# EAGLE board EtherMegaR3 (EAGLE 9.4.2), part 1 of 2
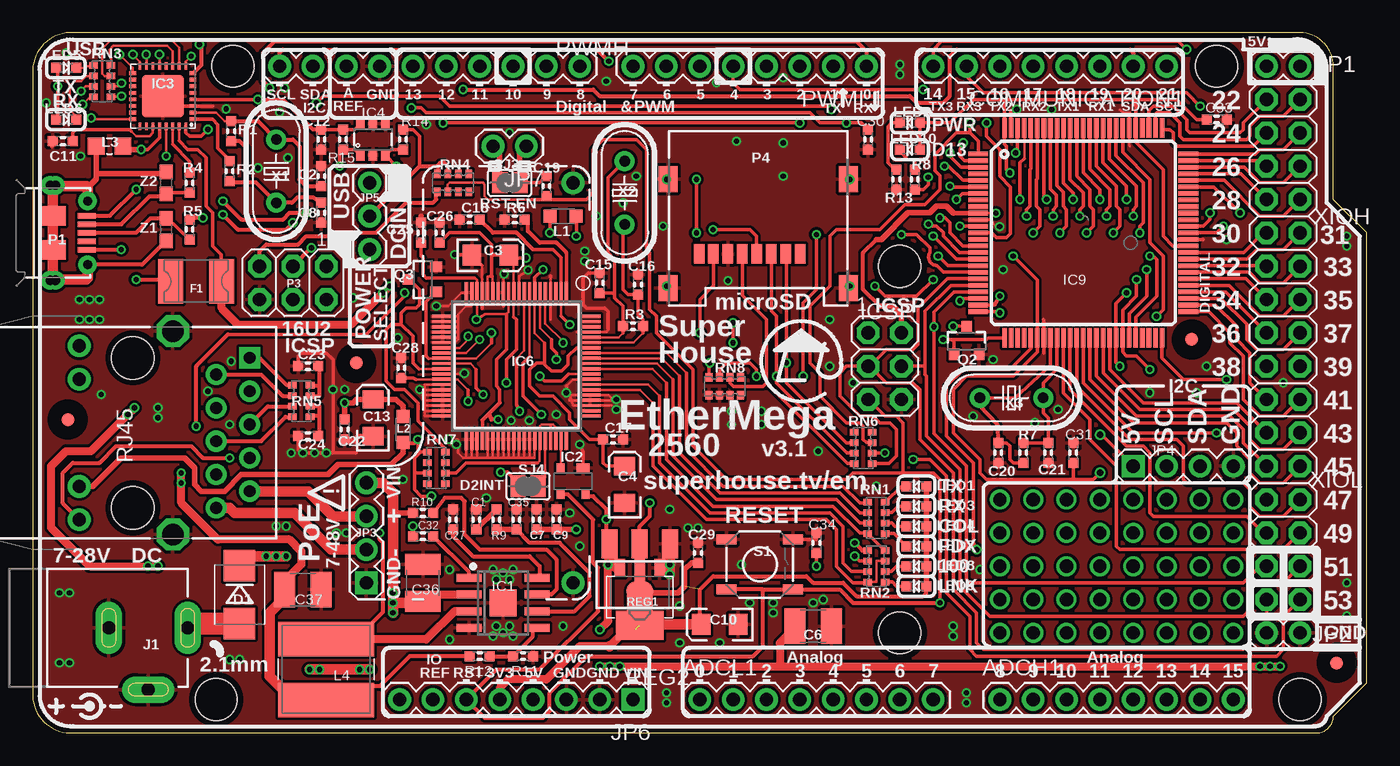
[diagram p1: board, top side]
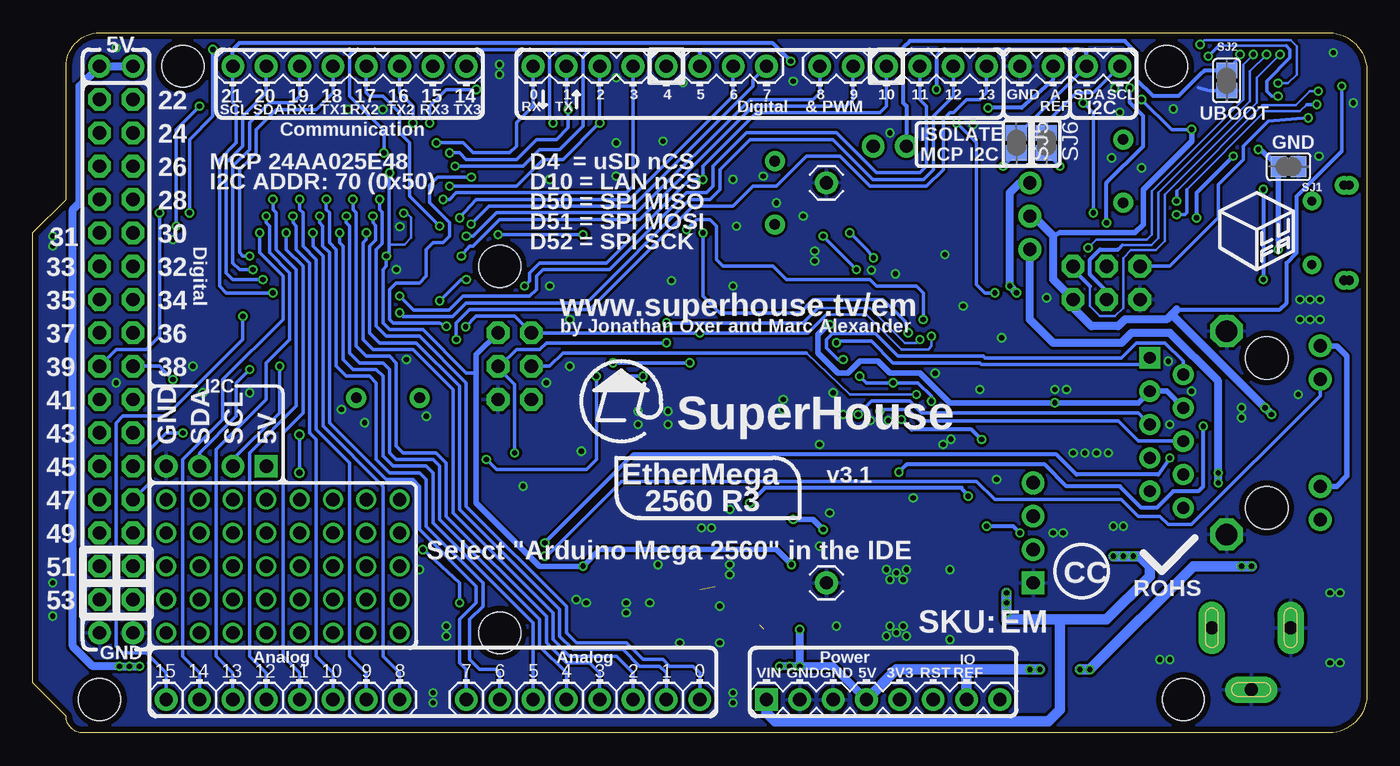
[diagram p2: board, bottom side, seen from below]

Size 101.6 x 53.34 mm. Coordinates in mm from the lower left corner, seen from the top.
Outline: 0,2.54 arc74 2.54,0 97.79,0 arc90 99.06,1.27 101.6,3.81 101.6,38.1 99.06,40.64 99.06,50.8 arc90 96.52,53.34 2.54,53.34 arc74 0,50.8 0,2.54
Copper layers (1*16): Top 0.035mm / dielectric 1.5mm / Bottom 0.035mm
Design rules "default": minimum track width 8mil, minimum drill 15mil, track to track 8mil, track to pad 8mil, pad to pad 8mil, via to via 8mil, smd to smd 6mil, copper to edge 18mil, drill to drill 8mil, minimum pad ring 14mil, minimum via ring 6mil, stop-mask expansion 4mil, vias tented up to drill 25mil, thermal gap 10mil
Holes 3.2 mm at 66.04,35.56 66.04,7.62 13.97,2.54 15.24,50.8 96.52,2.54 90.17,50.8
tRestrict: area 23.6,27.2 to 25.7,29.2; area 87.2,29 to 89.3,31; area 1.7,22.9 to 3.7,24.9; area 98.3,4.3 to 100.3,6.3

## Footprints (pad centres in the part's own frame; a part is rotated, then mirrored left to right if it is on the bottom)
1X08-S = drill 1.016: 1 0,0; 2 2.54,0; 3 5.08,0; 4 7.62,0; 5 10.16,0; 6 12.7,0; 7 15.24,0; 8 17.78,0
C0603 = smd 0.762 x 0.762: 1 -0.762,0; 2 0.762,0
EIA3216 = smd 1.4 x 1.6: A 1.4,0; C -1.4,0
C1210 = smd 1.6 x 2.7: 1 -1.4,0; 2 1.4,0
0603 = smd 0.762 x 0.762: 1 -0.762,0; 2 0.762,0
SMB-DIODE = smd 2.4 x 2.4: A 2.2,0; C -2.2,0
1812 = smd 1.9 x 3.4: 1 -1.95,0; 2 1.95,0
FIDUCIAL-1X2.5 = smd 1 x 1: 1 0,0
SO08T = smd 1.905 x 0.6: 1 -2.6,1.905; 2 -2.6,0.635; 3 -2.6,-0.635; 4 -2.6,-1.905; 5 2.6,-1.905; 6 2.6,-0.635; 7 2.6,0.635; 8 2.6,1.905 | smd 2.057 x 2.057: 9 0,0
SOT143-R = smd 1 x 0.7: 1 -0.75,-1 | smd 0.6 x 0.7: 2 0.95,-1; 3 0.95,1; 4 -0.95,1
ATMEL_QFN32 = smd 0.6 x 0.3: 1 -2.3,1.75; 2 -2.3,1.25; 3 -2.3,0.75; 4 -2.3,0.25; 5 -2.3,-0.25; 6 -2.3,-0.75; 7 -2.3,-1.25; 8 -2.3,-1.75; 17 2.3,-1.75; 18 2.3,-1.25; 19 2.3,-0.75; 20 2.3,-0.25; 21 2.3,0.25; 22 2.3,0.75; 23 2.3,1.25; 24 2.3,1.75 | smd 0.3 x 0.6: 9 -1.75,-2.3; 10 -1.25,-2.3; 11 -0.75,-2.3; 12 -0.25,-2.3; 13 0.25,-2.3; 14 0.75,-2.3; 15 1.25,-2.3; 16 1.75,-2.3; 25 1.75,2.3; 26 1.25,2.3; 27 0.75,2.3; 28 0.25,2.3; 29 -0.25,2.3; 30 -0.75,2.3; 31 -1.25,2.3; 32 -1.75,2.3 | smd 3.2 x 3.2: EXP 0,0
SOT23-6 = smd 0.65 x 0.8: 1 -0.95,-1.2; 2 0,-1.2; 3 0.95,-1.2; 4 0.95,1.2; 5 0,1.2; 6 -0.95,1.2
SQFP80 = smd 1.6 x 0.25: 1 -5.6,3.8; 2 -5.6,3.4; 3 -5.6,3; 4 -5.6,2.6; 5 -5.6,2.2; 6 -5.6,1.8; 7 -5.6,1.4; 8 -5.6,1; 9 -5.6,0.6; 10 -5.6,0.2; 11 -5.6,-0.2; 12 -5.6,-0.6; 13 -5.6,-1; 14 -5.6,-1.4; 15 -5.6,-1.8; 16 -5.6,-2.2; 17 -5.6,-2.6; 18 -5.6,-3; 19 -5.6,-3.4; 20 -5.6,-3.8; 41 5.6,-3.8; 42 5.6,-3.4; 43 5.6,-3; 44 5.6,-2.6; 45 5.6,-2.2; 46 5.6,-1.8; 47 5.6,-1.4; 48 5.6,-1; 49 5.6,-0.6; 50 5.6,-0.2; 51 5.6,0.2; 52 5.6,0.6; 53 5.6,1; 54 5.6,1.4; 55 5.6,1.8; 56 5.6,2.2; 57 5.6,2.6; 58 5.6,3; 59 5.6,3.4; 60 5.6,3.8 | smd 0.25 x 1.6: 21 -3.8,-5.6; 22 -3.4,-5.6; 23 -3,-5.6; 24 -2.6,-5.6; 25 -2.2,-5.6; 26 -1.8,-5.6; 27 -1.4,-5.6; 28 -1,-5.6; 29 -0.6,-5.6; 30 -0.2,-5.6; 31 0.2,-5.6; 32 0.6,-5.6; 33 1,-5.6; 34 1.4,-5.6; 35 1.8,-5.6; 36 2.2,-5.6; 37 2.6,-5.6; 38 3,-5.6; 39 3.4,-5.6; 40 3.8,-5.6; 61 3.8,5.6; 62 3.4,5.6; 63 3,5.6; 64 2.6,5.6; 65 2.2,5.6; 66 1.8,5.6; 67 1.4,5.6; 68 1,5.6; 69 0.6,5.6; 70 0.2,5.6; 71 -0.2,5.6; 72 -0.6,5.6; 73 -1,5.6; 74 -1.4,5.6; 75 -1.8,5.6; 76 -2.2,5.6; 77 -2.6,5.6; 78 -3,5.6; 79 -3.4,5.6; 80 -3.8,5.6
TQFP100 = smd 1.5 x 0.35: 1 -8,6; 2 -8,5.5; 3 -8,5; 4 -8,4.5; 5 -8,4; 6 -8,3.5; 7 -8,3; 8 -8,2.5; 9 -8,2; 10 -8,1.5; 11 -8,1; 12 -8,0.5; 13 -8,0; 14 -8,-0.5; 15 -8,-1; 16 -8,-1.5; 17 -8,-2; 18 -8,-2.5; 19 -8,-3; 20 -8,-3.5; 21 -8,-4; 22 -8,-4.5; 23 -8,-5; 24 -8,-5.5; 25 -8,-6; 51 8,-6; 52 8,-5.5; 53 8,-5; 54 8,-4.5; 55 8,-4; 56 8,-3.5; 57 8,-3; 58 8,-2.5; 59 8,-2; 60 8,-1.5; 61 8,-1; 62 8,-0.5; 63 8,0; 64 8,0.5; 65 8,1; 66 8,1.5; 67 8,2; 68 8,2.5; 69 8,3; 70 8,3.5; 71 8,4; 72 8,4.5; 73 8,5; 74 8,5.5; 75 8,6 | smd 0.35 x 1.5: 26 -6,-8; 27 -5.5,-8; 28 -5,-8; 29 -4.5,-8; 30 -4,-8; 31 -3.5,-8; 32 -3,-8; 33 -2.5,-8; 34 -2,-8; 35 -1.5,-8; 36 -1,-8; 37 -0.5,-8; 38 0,-8; 39 0.5,-8; 40 1,-8; 41 1.5,-8; 42 2,-8; 43 2.5,-8; 44 3,-8; 45 3.5,-8; 46 4,-8; 47 4.5,-8; 48 5,-8; 49 5.5,-8; 50 6,-8; 76 6,8; 77 5.5,8; 78 5,8; 79 4.5,8; 80 4,8; 81 3.5,8; 82 3,8; 83 2.5,8; 84 2,8; 85 1.5,8; 86 1,8; 87 0.5,8; 88 0,8; 89 -0.5,8; 90 -1,8; 91 -1.5,8; 92 -2,8; 93 -2.5,8; 94 -3,8; 95 -3.5,8; 96 -4,8; 97 -4.5,8; 98 -5,8; 99 -5.5,8; 100 -6,8
2X03 = drill 1.016 octagon: 1 -2.54,-1.27; 2 -2.54,1.27; 3 0,-1.27; 4 0,1.27; 5 2.54,-1.27; 6 2.54,1.27
POWER_JACK_SLOTS = drill 1 pad 2 long: GND 0,7.7; GNDBREAK 4.7,10.7; PWR 0,13.7
1X02 = drill 1.016: 1 0,0; 2 2.54,0
FT-POE-MODULE-CLEAN = drill 1.016 square: 1 0,0 | drill 1.016: 2 2.54,0; 3 5.08,0; 4 7.62,0; MNT1 0,-15.748; MNT2 30.48,-15.748
1X04 = drill 1.016 square: 1 0,0 | drill 1.016: 2 2.54,0; 3 5.08,0; 4 7.62,0
1X03-P = drill 1.016: 1 0,0; 2 2.54,0; 3 5.08,0
1X08 = drill 1.016 square: 1 0,0 | drill 1.016: 2 2.54,0; 3 5.08,0; 4 7.62,0; 5 10.16,0; 6 12.7,0; 7 15.24,0; 8 17.78,0
L2012C = smd 1 x 1: 1 -1,0; 2 1,0
0805-LARGE = smd 1.27 x 1.27: 1 -1.016,0; 2 1.016,0
CDRH = smd 7.3 x 2.65: 1 0,2.325; 2 0,-2.325
LED-0603 = smd 0.762 x 0.762: A -0.762,0; C 0.762,0
USB-MICROB-MB05PMXX = smd 0.4 x 1.35: D+ 0,2.575; D- -0.65,2.575; GND 1.3,2.575; ID 0.65,2.575; VBUS -1.3,2.575 | smd 1.5 x 2: FIX1 -1.3,0; FIX2 1.3,0 | drill 0.7: PIN1 -2.425,2.65; PIN2 2.425,2.65; SLOT1 -3.625,-0.2; SLOT2 3.625,-0.2; TAB1 -3.625,0.2; TAB2 3.625,0.2
MOLEX-SD-500901-003 = smd 0.8 x 1.5: 1 -3.2,9.35; 2 -2.1,9.35; 3 -1,9.35; 4 0.1,9.35; 5 1.2,9.35; 6 2.3,9.35; 7 3.4,9.35; 8 4.5,9.35 | smd 1.45 x 2: GND1 6.875,11.95; GND2 -6.875,11.95; GND3 6.875,3.65; GND4 -6.875,3.65
1X10 = drill 1.016: 1 0,0; 2 2.54,0; 3 5.08,0; 4 7.62,0; 5 10.16,0; 6 12.7,0; 7 15.24,0; 8 17.78,0; 9 20.32,0; 10 22.86,0
SOT23-3 = smd 0.8 x 0.9: 1 -0.95,-1; 2 0.95,-1; 3 0,1.1
R0603 = smd 0.762 x 0.762: 1 -0.762,0; 2 0.762,0
SOT89 = smd 0.8 x 1.4: 1 -1.524,-1.905; 3 1.524,-1.905 | smd 0.8 x 1.9: 2 0,-1.651 | smd 2.032 x 3.65: 4 0,0.94
SOT-223 = smd 1.219 x 2.235: 1 -2.311,-3.099; 2 0,-3.099; 3 2.311,-3.099 | smd 3.6 x 2.2: 4 0,3.099
CAY16 = smd 0.5 x 0.65: 1 -1.2,-0.675; 2 -0.4,-0.675; 3 0.4,-0.675; 4 1.2,-0.675; 5 1.2,0.675; 6 0.4,0.675; 7 -0.4,0.675; 8 -1.2,0.675
TACTILE_SMD-6MM = smd 1.524 x 0.762: 1 -2.54,1.905; 2 2.54,1.905; 3 -2.54,-1.905; 4 2.54,-1.905
SJ = smd 1.168 x 1.6: 1 -0.762,0; 2 0.762,0
SJC = smd 1.168 x 1.6: 1 -0.762,0; 2 0.762,0
HY931147C = drill 1.63 octagon: GND1 3.05,7.745; GND2 3.05,-7.745 | drill 0.9 square: P$1 8.89,5.715 | drill 0.9: P$2 6.35,4.445; P$3 8.89,3.175; P$4 6.35,1.905; P$5 8.89,0.635; P$6 6.35,-0.635; P$7 8.89,-1.905; P$8 6.35,-3.175; P$9 8.89,-4.445; P$10 6.35,-5.715 | drill 1.016: P$11 -4.08,6.625; P$12 -4.08,4.085; P$13 -4.08,-4.085; P$14 -4.08,-6.625 | hole 3.25: 0,5.715; 0,-5.715
HC49U-V = drill 0.813: 1 -2.413,0; 2 2.413,0
2X08 = drill 1.016 octagon: 1 -8.89,-1.27; 2 -8.89,1.27; 3 -6.35,-1.27; 4 -6.35,1.27; 5 -3.81,-1.27; 6 -3.81,1.27; 7 -1.27,-1.27; 8 -1.27,1.27; 9 1.27,-1.27; 10 1.27,1.27; 11 3.81,-1.27; 12 3.81,1.27; 13 6.35,-1.27; 14 6.35,1.27; 15 8.89,-1.27; 16 8.89,1.27
0603' = smd 1.1 x 1: 1 -0.85,0; 2 0.85,0

## Placement (x,y rotation side)
ADCH1  M08-SOCKET  [1X08-S]  73.66,2.54 0 top
ADCL1  M08-SOCKET  [1X08-S]  50.8,2.54 0 top
C1  2.2nF 0603  [C0603]  33.78,16.26 90 top
C2  22pF 0603  [C0603]  21.97,42.42 270 top
C3  10uF 6.3V A TANT  [EIA3216]  34.85,36.4 0 top
C4  10uF 6.3V A TANT  [EIA3216]  45.09,18.92 90 top
C6  47uF 50V 1210 ceramic  [C1210]  59.44,8.13 180 top
C7  100nF 0603  [C0603]  38.35,16.26 90 top
C8  22pF 0603  [C0603]  21.97,39.62 90 top
C9  1uF 0603  [C0603]  39.88,16.26 90 top
C10  10uF 6.3V A TANT  [EIA3216]  52.32,8.26 180 top
C11  1uF 0603  [C0603]  2.29,45.09 180 top
C12  100nF 0603  [C0603]  21.97,45.21 270 top
C13  10uF 6.3V A TANT  [EIA3216]  25.91,24 90 top
C15  13pF  [C0603]  43.18,34.29 90 top
C16  13pF  [C0603]  46.1,34.16 90 top
C17  100nF  [C0603]  44.2,22.35 0 top
C18  10nF  [0603]  33.27,39.12 180 top
C19  100nF 0603  [C0603]  39.12,41.66 270 top
C20  22pF 0603  [C0603]  73.53,21.34 90 top
C21  22pF 0603  [C0603]  77.34,21.34 90 top
C22  100nF  [C0603]  23.75,23.11 270 top
C23  100nF  [C0603]  20.95,27.94 180 top
C24  100nF  [C0603]  20.95,22.61 180 top
C25  100nF  [C0603]  29.59,38.1 90 top
C26  100nF  [C0603]  30.99,38.1 90 top
C27  100nF 0603  [C0603]  32,16.26 90 top
C28  100nF  [C0603]  28.07,27.81 90 top
C29  100nF 0603  [C0603]  50.67,13.72 90 top
C30  100nF  [C0603]  63.63,45.21 270 top
C31  100nF  [C0603]  79.25,21.34 90 top
C32  10nF 50V 0603  [C0603]  29.72,14.99 0 top
C33  100nF  [C0603]  90.17,46.74 0 top
C34  100nF  [C0603]  59.69,14.48 90 top
C35  22pF NOT PLACED  [C0603]  36.83,16.26 90 top
C36  10uF 50V 1210 ceramic  [C1210]  29.72,11.43 90 top
C37  22uF 10V 1210 ceramic  [C1210]  20.57,10.92 0 top
COMMUNICATION1  M08-SOCKET  [1X08-S]  86.36,50.8 180 top
D1  1N4004 SMB  [SMB-DIODE]  15.75,10.54 270 top
F1  500mA PTC 1812  [1812]  12.45,34.42 0 top
FID1  FIDUCIAL1X2.5  [FIDUCIAL-1X2.5]  24.64,28.19 0 top
FID2  FIDUCIAL1X2.5  [FIDUCIAL-1X2.5]  88.27,29.97 0 top
FID3  FIDUCIAL1X2.5  [FIDUCIAL-1X2.5]  2.67,23.88 0 top
FID4  FIDUCIAL1X2.5  [FIDUCIAL-1X2.5]  99.31,5.33 90 top
IC1  EUP3476SO08T  [SO08T]  35.81,9.91 0 top
IC2  APX811-44UG-7  [SOT143-R]  41.15,19.18 180 top
IC3  ATMEGA16U2-MU  [ATMEL_QFN32]  9.91,48.51 180 top
IC4  MCP24AA025E48  [SOT23-6]  25.91,45.21 0 top
IC6  W5100SQFP80  [SQFP80]  36.83,27.94 270 top
IC9  ATMEGA2560-16AU  [TQFP100]  80.01,38.1 0 top
ICSP  ICSP:MAIN  [2X03]  64.9,27.94 270 top
J1  DC_2_1MM  [POWER_JACK_SLOTS]  -1.91,8 270 top
JP1  [1X02]  93.98,50.8 0 top
JP2  [1X02]  93.98,7.62 0 top
JP3  FT-POE-MODULE  [FT-POE-MODULE-CLEAN]  25.4,11.43 90 top
JP4  [1X04]  83.82,20.32 0 top
JP5  [1X03-P]  25.65,41.91 270 top
JP6  [1X08]  45.72,2.54 180 top
JP7  [1X02]  37.59,44.7 180 top
L1  1uH 250mA 0805  [L2012C]  40.39,39.37 0 top
L2  1uH 250mA 0805  [L2012C]  28.19,23.11 90 top
L3  0805 INDUCTOR  [0805-LARGE]  5.84,44.7 0 top
L4  CDRH6D38SMT  [CDRH]  22.35,4.83 0 top
LED1  YELLOW  [LED-0603]  67.31,18.8 180 top
LED2  PWR/BLUE  [LED-0603]  66.8,46.48 180 top
LED3  YELLOW  [LED-0603]  67.31,17.27 180 top
LED4  RED  [LED-0603]  67.31,15.75 180 top
LED5  TX/YEL  [LED-0603]  2.54,50.67 0 top
LED6  RX/GRN  [LED-0603]  2.54,46.74 0 top
LED7  GREEN  [LED-0603]  67.31,14.22 180 top
LED8  GREEN  [LED-0603]  67.31,12.7 180 top
LED9  YELLOW  [LED-0603]  67.31,11.18 180 top
LED10  D13/RED  [LED-0603]  66.8,44.45 180 top
P1  USB-6P-SMT  [USB-MICROB-MB05PMXX]  1.52,38.1 270 top
P3  ICSP:USB  [2X03]  19.81,34.29 180 top
P4  microSD  [MOLEX-SD-500901-003]  55.24,45.85 180 top
PWMH  [1X10]  41.66,50.8 180 top
PWML1  M08-SOCKET  [1X08-S]  63.5,50.8 180 top
Q2  2N7002  [SOT23-3]  71.12,29.84 0 top
Q3  2N7002  [SOT23-3]  29.72,34.54 90 top
R1  1M 0603  [R0603]  15.11,45.85 90 top
R2  27R 0603  [R0603]  14.99,42.8 270 top
R3  1M  [R0603]  45.72,30.99 0 top
R4  22R 0603  [R0603]  11.94,41.91 270 top
R5  22R 0603  [R0603]  11.94,38.35 270 top
R6  12K3 1%  [R0603]  36.7,39.12 0 top
R7  1M 0603  [R0603]  75.44,21.34 270 top
R8  1K 0603  [R0603]  67.18,42.16 90 top
R9  15K 0603  [R0603]  35.31,16.26 270 top
R10  100K 0603  [R0603]  29.72,16.76 0 top
R11  10K 1%  [R0603]  37.34,5.84 180 top
R12  53.6K 1%  [0603]  34.04,5.84 180 top
R13  1K 0603  [R0603]  65.79,42.16 90 top
R14  4K7  [R0603]  28.19,45.21 270 top
R15  4K7  [R0603]  23.62,45.21 270 top
REG1  LD1117-SOT89  [SOT89]  46.23,10.67 180 top
REG2  LD1117-SOT223  [SOT-223]  46.23,11.3 180 top
RN1  1K  [CAY16]  64.26,16.38 270 top
RN2  1K  [CAY16]  64.26,12.7 270 top
RN3  1K  [CAY16]  5.28,49.66 270 top
RN4  10K  [CAY16]  32,41.91 0 top
RN5  49R9 1%  [CAY16]  20.45,25.27 270 top
RN6  1K  [CAY16]  63.25,21.72 270 top
RN7  1K  [CAY16]  30.73,20.19 90 top
RN8  2K2  [CAY16]  52.7,26.42 0 top
S1  RESET  [TACTILE_SMD-6MM]  55.37,12.83 0 top
SJ1  GROUND  [SJ]  5.95,43.15 0 bottom
SJ2  UBOOT  [SJ]  10.67,49.7 90 bottom
SJ3  RESET-EN  [SJ]  36.32,41.91 0 top
SJ4  D2_INT  [SJ]  37.72,18.8 0 top
SJ5  [SJC]  26.67,44.96 270 bottom
SJ6  [SJC]  24.38,44.96 270 bottom
U1  HY931147C-RJ45  [HY931147C]  7.62,22.86 0 top
X1  16MHz  [HC49U-V]  18.54,42.8 90 top
X2  25MHz  [HC49U-V]  45.09,41.15 270 top
X3  16MHz  [HC49U-V]  74.55,25.53 180 top
XIOH  [2X08]  95.25,39.37 90 top
XIOL  [2X08]  95.25,19.05 90 top
Z1  PGB1010603  [0603']  10.16,38.35 270 top
Z2  PGB1010603  [0603']  10.16,41.91 90 top